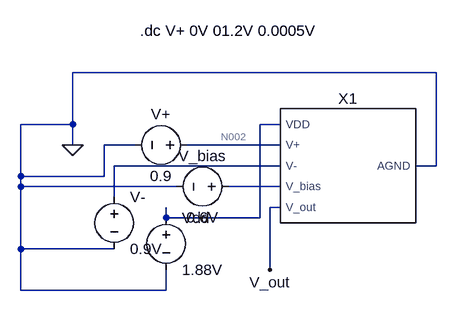
[diagram p0: schematic ota_testbench.asc]
ota_testbench.asc, the LTspice schematic file:
Version 4.1
SHEET 1 880 680
WIRE 336 32 -224 32
WIRE -224 112 -224 32
WIRE -224 112 -304 112
WIRE 96 112 64 112
WIRE -224 144 -224 112
WIRE -128 144 -176 144
WIRE 96 144 -48 144
WIRE 96 176 -160 176
WIRE 336 176 336 32
WIRE 336 176 304 176
WIRE -304 192 -304 112
WIRE -176 192 -176 144
WIRE -176 192 -304 192
WIRE -304 208 -304 192
WIRE -64 208 -304 208
WIRE 96 208 16 208
WIRE -160 224 -160 176
WIRE 96 240 80 240
WIRE -80 256 -80 240
WIRE 64 256 64 112
WIRE 64 256 -80 256
WIRE -304 304 -304 208
WIRE -160 304 -304 304
WIRE 80 336 80 240
WIRE -304 368 -304 304
WIRE -80 368 -80 336
WIRE -80 368 -304 368
FLAG -224 144 0
FLAG 80 336 V_out
SYMBOL voltage -80 240 R0
SYMATTR InstName Vdd
SYMATTR Value 1.88V
SYMBOL voltage -160 208 R0
SYMATTR InstName V-
SYMATTR Value 0.9V
SYMBOL voltage 32 208 R90
WINDOW 0 -32 56 VBottom 2
WINDOW 3 32 56 VTop 2
WINDOW 123 0 0 Left 0
WINDOW 39 0 0 Left 0
SYMATTR InstName V_bias
SYMATTR Value 0.6V
SYMBOL voltage -32 144 R90
WINDOW 0 -32 56 VBottom 2
WINDOW 3 32 56 VTop 2
SYMATTR InstName V+
SYMATTR Value 0.9
SYMBOL ota_core\\ota_core 192 176 R0
SYMATTR InstName X1
TEXT -120 -32 Left 2 !.dc V+ 0V 01.2V 0.0005V

The netlist it stands for:
* ota_testbench.asc
Vdd N001 0 1.88V
V- N003 0 0.9V
V_bias N004 0 0.6V
V+ N002 0 0.9
X§X1 N001 N002 N003 N004 V_out 0 ota_core  ; pins VDD V+ V- V_bias V_out AGND
.dc V+ 0V 01.2V 0.0005V
.backanno
.end

* Results of the author's LTspice run, read from the files saved beside the schematic
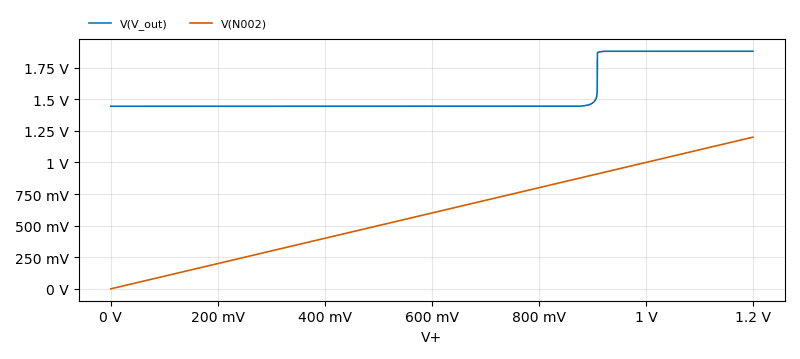
[diagram p1: DC transfer characteristic of ota_testbench.asc, plotted from the saved traces]
* DC transfer characteristic, 1 run:
*   V(V_out): 1.445 V at V+=0 V, 1.88 V at V+=1.2 V, min 1.445 V, max 1.88 V
*   V(N002): 0 V at V+=0 V, 1.2 V at V+=1.2 V, min 0 V, max 1.2 V